# Altium schematic sheet USB to RS232 Converter.SchDoc
size A4
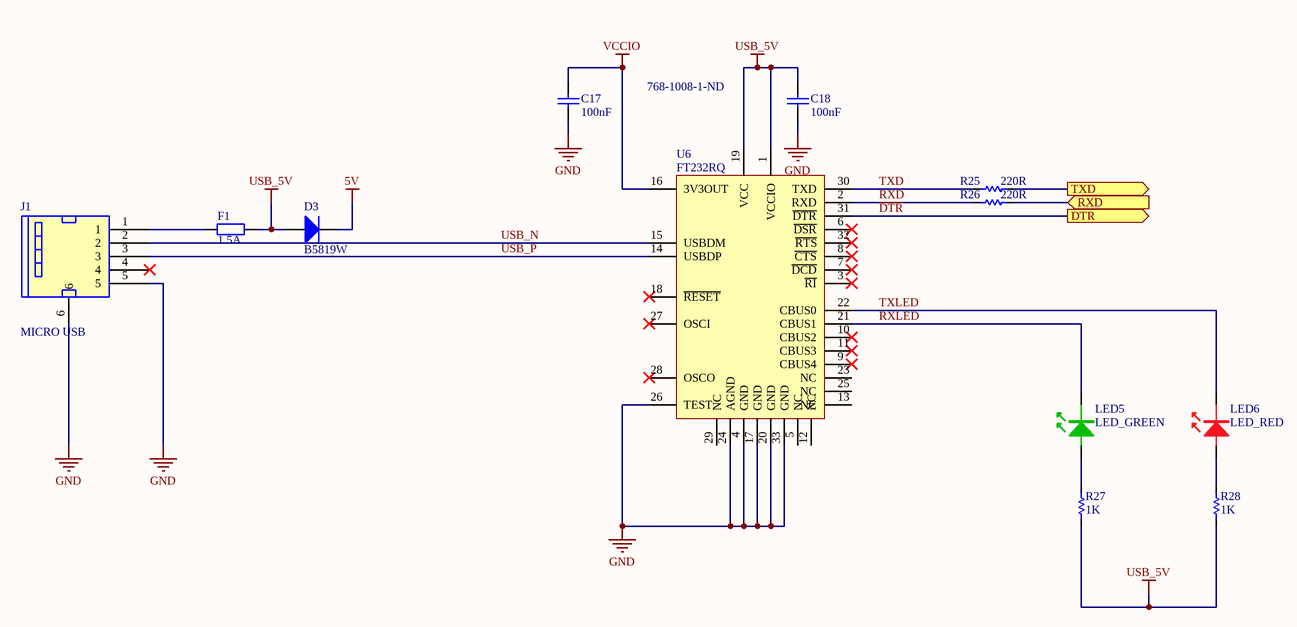
[diagram p0: USB to RS232 Converter.SchDoc]

## Parts
C17  100nF  [C0603(1608)]
C18  100nF  [C0603(1608)]
D3  B5819W  [SOD-123]
F1  1.5A  [FUSE_1206(3216)]
J1  MICRO USB  [MICRO_USB]
LED5  LED_GREEN  [L0603_GRE]
LED6  LED_RED  [L0603_RED]
R25  220R  [R0603(1608)]
R26  220R  [R0603(1608)]
R27  1K  [R0603(1608)]
R28  1K  [R0603(1608)]
U6  FT232RQ  Supplier Part Number 1: 768-1008-1-ND  [QFN-32]

## Ports
DTR (out), RXD (in), TXD (out)

## Nets
5V: D3.1(A)
GND: C17.1 C18.1 J1.5 J1.6 U6.4(GND) U6.17(GND) U6.20(GND) U6.24(AGND) U6.26(TEST) U6.33(GND)
USB_5V: C18.2 D3.2(K) F1.2 R27.2 R28.2 U6.1(VCCIO) U6.19(VCC)
VCCIO: C17.2 U6.16(3V3OUT)
~{DTR}: U6.31(~{DTR}) ; port DTR
RXD: R26.1 U6.2(RXD)
RXD: R26.2 ; port RXD  [a separate net that carries the same name]
RXLED: LED5.2(K) U6.21(CBUS1)
TXD: R25.1 U6.30(TXD)
TXD: R25.2 ; port TXD  [a separate net that carries the same name]
TXLED: LED6.2(K) U6.22(CBUS0)
USB_N: J1.2 U6.15(USBDM)
USB_P: J1.3 U6.14(USBDP)
NetF1_1: F1.1 J1.1
NetLED5_1: LED5.1(A) R27.1
NetLED6_1: LED6.1(A) R28.1

Not connected (* = marked no-connect by the designer): J1 4*; U6 3(~{RI})* 5(NC) 6(~{DSR})* 7(~{DCD})* 8(~{CTS})* 9(CBUS4)* 10(CBUS2)* 11(CBUS3)* 12(NC) 13(NC) 18(~{RESET})* 23(NC) 25(NC) 27(OSCI)* 28(OSCO)* 29(NC) 32(~{RTS})*

## Library data of the parts
C17 C18 = Cap: Capacitor
D3 = Diode: Default Diode; Published: 8-Jun-2000; LatestRevisionDate: 17-Jul-2002; LatestRevisionNote: Re-released for DXP Platform.; PackageVersion: Sep-1996; PackageReference: SMC; Publisher: Altium Limited; PackageDescription: DO-214-AB/SMC; 2 C-Bend Leads; Body 7.9 x 5.9 mm, inc. leads (LxW); Code_JEDEC: DO-214-AB
F1 = Res2: Ferrite Bead
J1 = MINI_USB: I/O Connector
R25-R28 = R: Resistor
U6 = IC_FT232RQ: FT232R USB UART; Manufacturer: FTDI, Future Technology Devices International Ltd; Manufacturer Part Number: FT232RQ-REEL; Function: Bridge, USB to UART; Standards: USB 2.0; Voltage - Supply: 3.3 V ~ 5.25 V; Current - Supply: 15mA; Supplier 1: Digi-Key; RoHS: RoHS Compliant; Category: Integrated Circuits (ICs); Stock 1: 15537; Pricing 1: 1=4.5, 10=4.05, 50=3.85, 100=3.65, 250=3.25, 500=3.05 (USD); Packaging: Cut Tape (CT); Protocol: USB; Interface: UART; Operating Temperature: -40°C ~ 85°C; Package / Case: 32-VFQFN Exposed Pad; Supplier Device Package: 32-QFN Exposed Pad (5x5); ComponentLink1URL: http://www.ftdichip.com/Support/Documents/DataSheets/ICs/DS_FT232R.pdf; ComponentLink1Description: http://www.ftdichip.com/Support/Documents/DataSheets/ICs/DS_FT232R.pdf